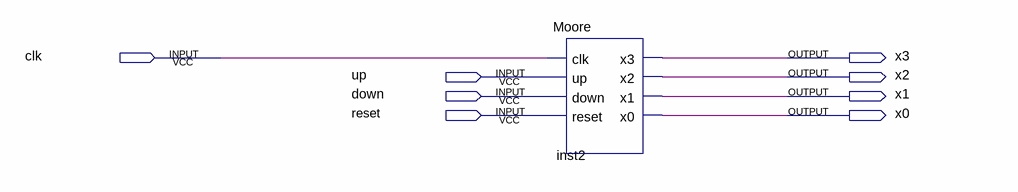
[diagram p0: schematic sheet]
// Quartus schematic Project.bdf as structural Verilog: 1 symbols, 8 pins
module Project (
  input  clk,
  input  up,
  input  down,
  input  reset,
  output x3,
  output x2,
  output x1,
  output x0
);

  Moore inst2 (.clk(clk), .up(up), .down(down), .reset(reset), .x3(x3), .x2(x2), .x1(x1), .x0(x0));
endmodule
